# EAGLE design controller11 (EAGLE 8.3.1)

## Sheet 1 of 2
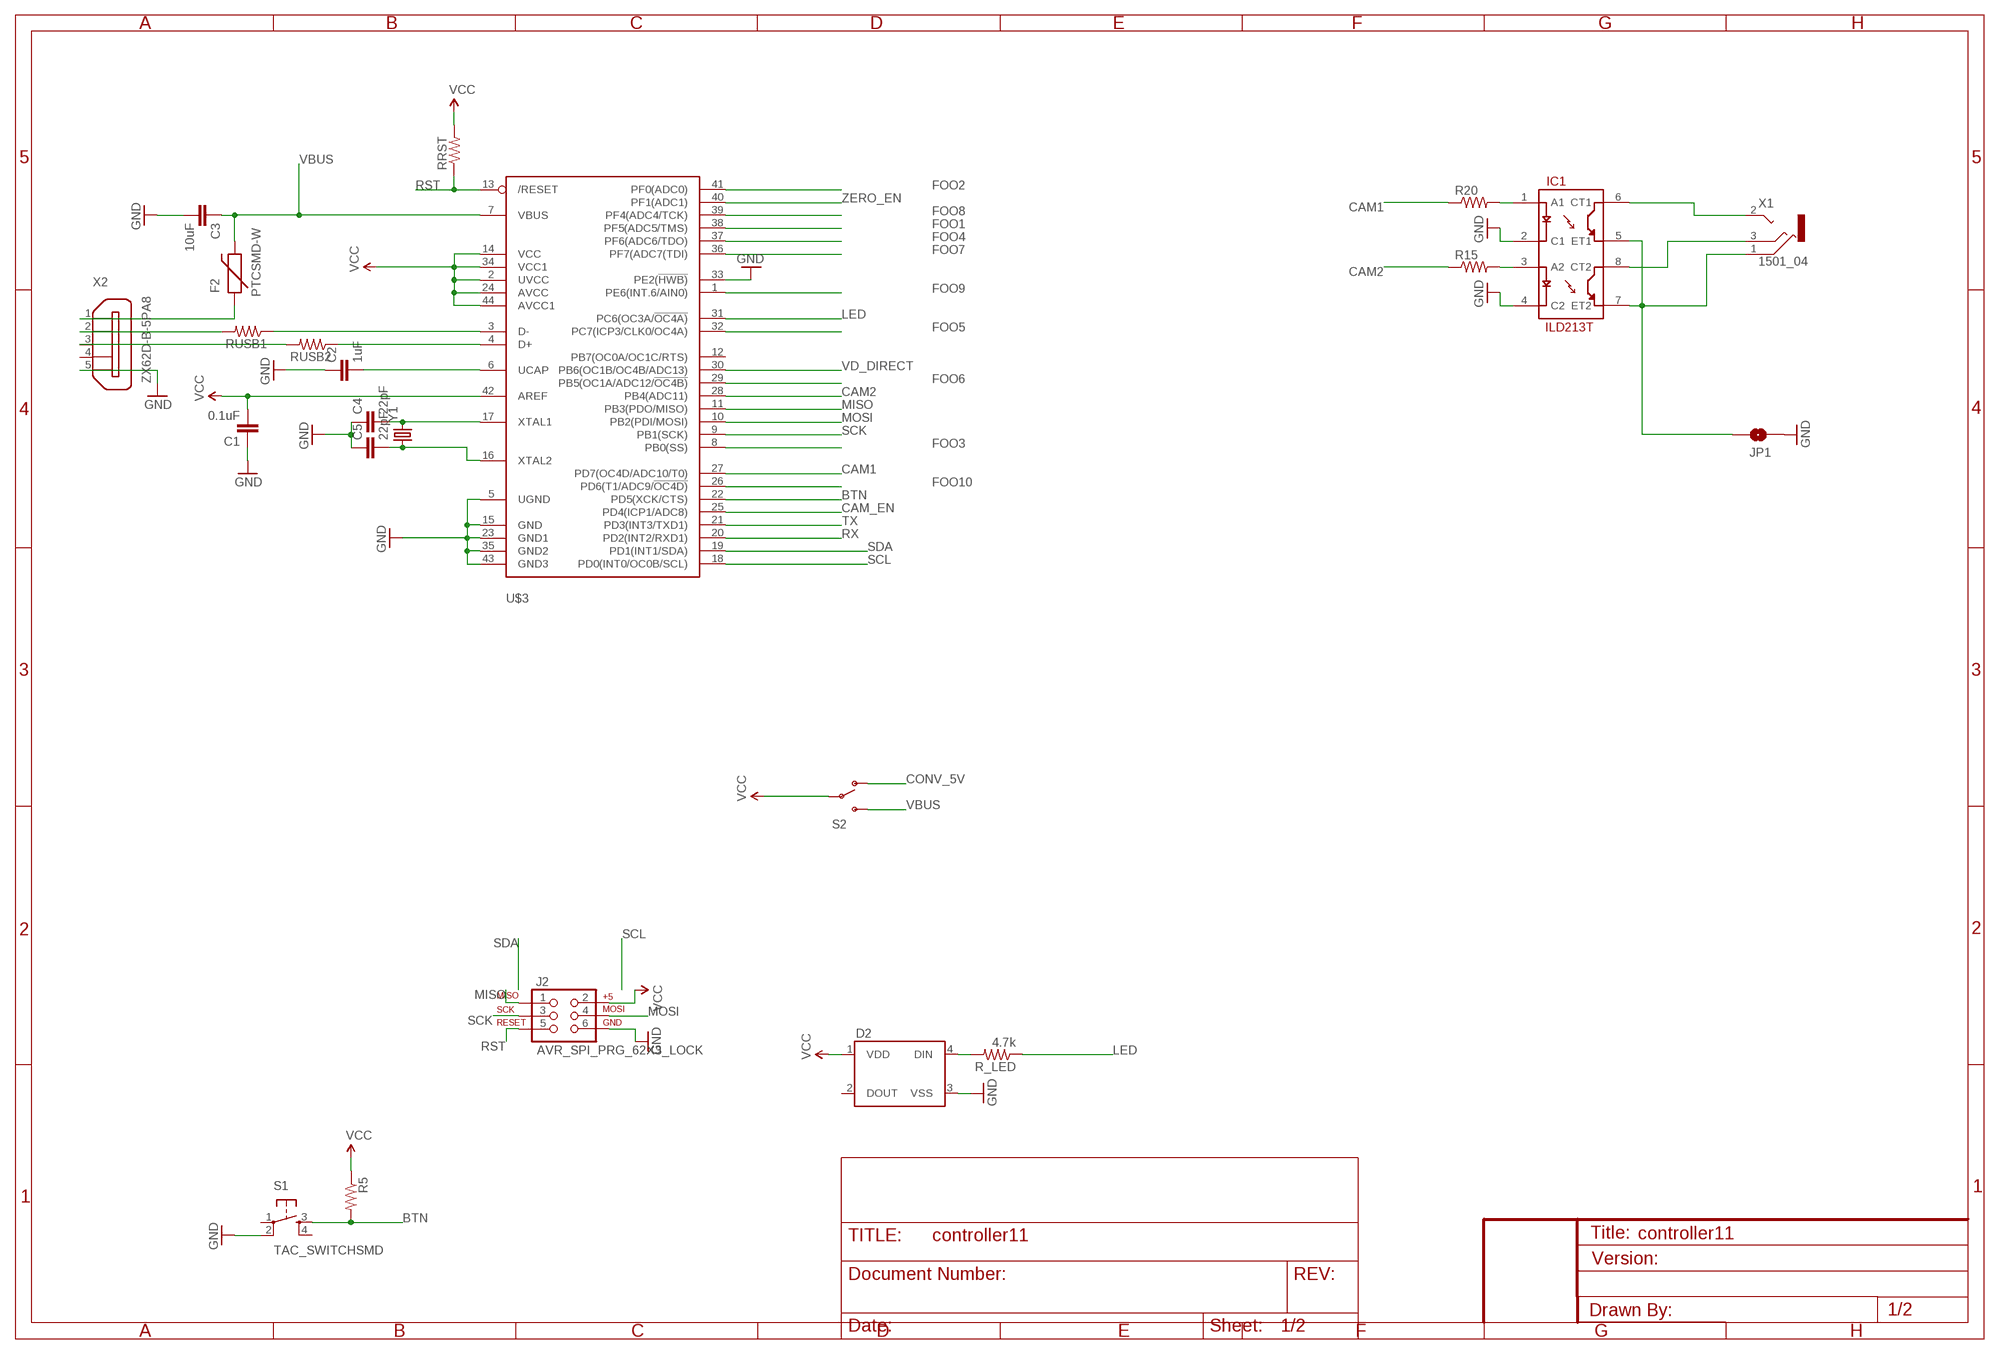
[diagram p0: schematic, sheet 1]

### Parts
C1  0.1uF  CAP1206  [1206]
C2  1uF  CAP1206  [1206]
C3  10uF  CAP1206  [1206]
C4  22pF  CAP1206  [1206]
C5  22pF  CAP1206  [1206]
D2  WS2812B  [WS2812B]
F2  PTCSMD-W  [PTC-1206-WIDE]
IC1  ILD213T  [SO08]
J2  AVR_SPI_PRG_62X3_LOCK  [2X3_LOCK]
JP1  JUMPER-PAD-2-NOYES_SILK  [PAD-JUMPER-2-NO_YES_SILK]
R5  RESISTOR1206  [1206]
R15  RESISTOR1206  [1206]
R20  RESISTOR1206  [1206]
R_LED  4.7k  RESISTOR1206  [1206]
RRST  RESISTOR1206  [1206]
RUSB1  RESISTOR1206  [1206]
RUSB2  RESISTOR1206  [1206]
S1  TAC_SWITCHSMD  [TACTILE-SWITCH-SMD]
S2  SWITCH-SPDTSMD2  [SWITCH-SPDT-SMD]
U$3  ATMEGA32U4-AU  [TQFP44]
X1  1501_04  [1501_05]
X2  ZX62D-B-5PA8  [ZX62D-B-5PA8]
Y1  CRYSTALCRYSTAL-SMD-5X3-16MHZ  [CRYSTAL-SMD-5X3]

### Nets
BTN: R5.2 S1.3 U$3.22(PD5(XCK/CTS))
CAM1: R20.1 U$3.27(PD7(OC4D/ADC10/T0))
CAM2: R15.1 U$3.28(PB4(ADC11))
CAM_EN: U$3.25(PD4(ICP1/ADC8)) ; also sheet 2
CONV_5V [power]: S2.1(O) ; also sheet 2
FOO1: U$3.38(PF5(ADC5/TMS))
FOO2: U$3.41(PF0(ADC0))
FOO3: U$3.8(PB0(SS))
FOO4: U$3.37(PF6(ADC6/TDO))
FOO5: U$3.32(PC7(ICP3/CLK0/OC4A))
FOO6: U$3.29(PB5(OC1A/ADC12/!OC4B))
FOO7: U$3.36(PF7(ADC7(TDI))
FOO8: U$3.39(PF4(ADC4/TCK))
FOO9: U$3.1(PE6(INT.6/AIN0))
FOO10: U$3.26(PD6(T1/ADC9/!OC4D))
GND: C1.1 C2.1 C3.2 C4.1 C5.1 D2.3(VSS) IC1.2(C1) IC1.4(C2) J2.6 JP1.1 S1.2 U$3.5(UGND) U$3.15(GND) U$3.23(GND1) U$3.33(PE2(!HWB)) U$3.35(GND2) U$3.43(GND3) X2.5 ; also sheet 2
LED: R_LED.1 U$3.31(PC6(OC3A/!OC4A))
MISO: J2.1 U$3.11(PB3(PDO/MISO))
MOSI: J2.4 U$3.10(PB2(PDI/MOSI))
N$4: RUSB1.1 U$3.3(D-)
N$5: RUSB2.1 U$3.4(D+)
N$7: D2.4(DIN) R_LED.2
N$8: C4.2 U$3.17(XTAL1) Y1.3
N$9: C5.2 U$3.16(XTAL2) Y1.1
N$10: RUSB1.2 X2.2
N$11: RUSB2.2 X2.3
N$12: IC1.6(CT1) X1.2
N$13: IC1.8(CT2) X1.3
N$15: IC1.3(A2) R15.2
N$19: IC1.1(A1) R20.2
N$20: C2.2 U$3.6(UCAP)
N$34: IC1.5(ET1) IC1.7(ET2) JP1.2 X1.1
N$38: F2.1 X2.1
RST: J2.5 RRST.1 U$3.13(/RESET)
RX: U$3.20(PD2(INT2/RXD1)) ; also sheet 2
SCK: J2.3 U$3.9(PB1(SCK))
SCL: U$3.18(PD0(INT0/OC0B/SCL))
SDA: U$3.19(PD1(INT1/SDA))
TX: U$3.21(PD3(INT3/TXD1)) ; also sheet 2
VBUS: C3.1 F2.2 S2.3(S) U$3.7(VBUS)
VCC [power]: C1.2 D2.1(VDD) J2.2 R5.1 RRST.2 S2.2(P) U$3.2(UVCC) U$3.14(VCC) U$3.24(AVCC) U$3.34(VCC1) U$3.42(AREF) U$3.44(AVCC1) ; also sheet 2
VD_DIRECT: U$3.30(PB6(OC1B/OC4B/ADC13)) ; also sheet 2
ZERO_EN: U$3.40(PF1(ADC1)) ; also sheet 2
Unconnected: D2.2(DOUT) S1.1 S1.4 U$3.12(PB7(OC0A/OC1C/RTS)) X2.4 X2.S1 X2.S2 X2.S3 X2.S4

## Sheet 2 of 2
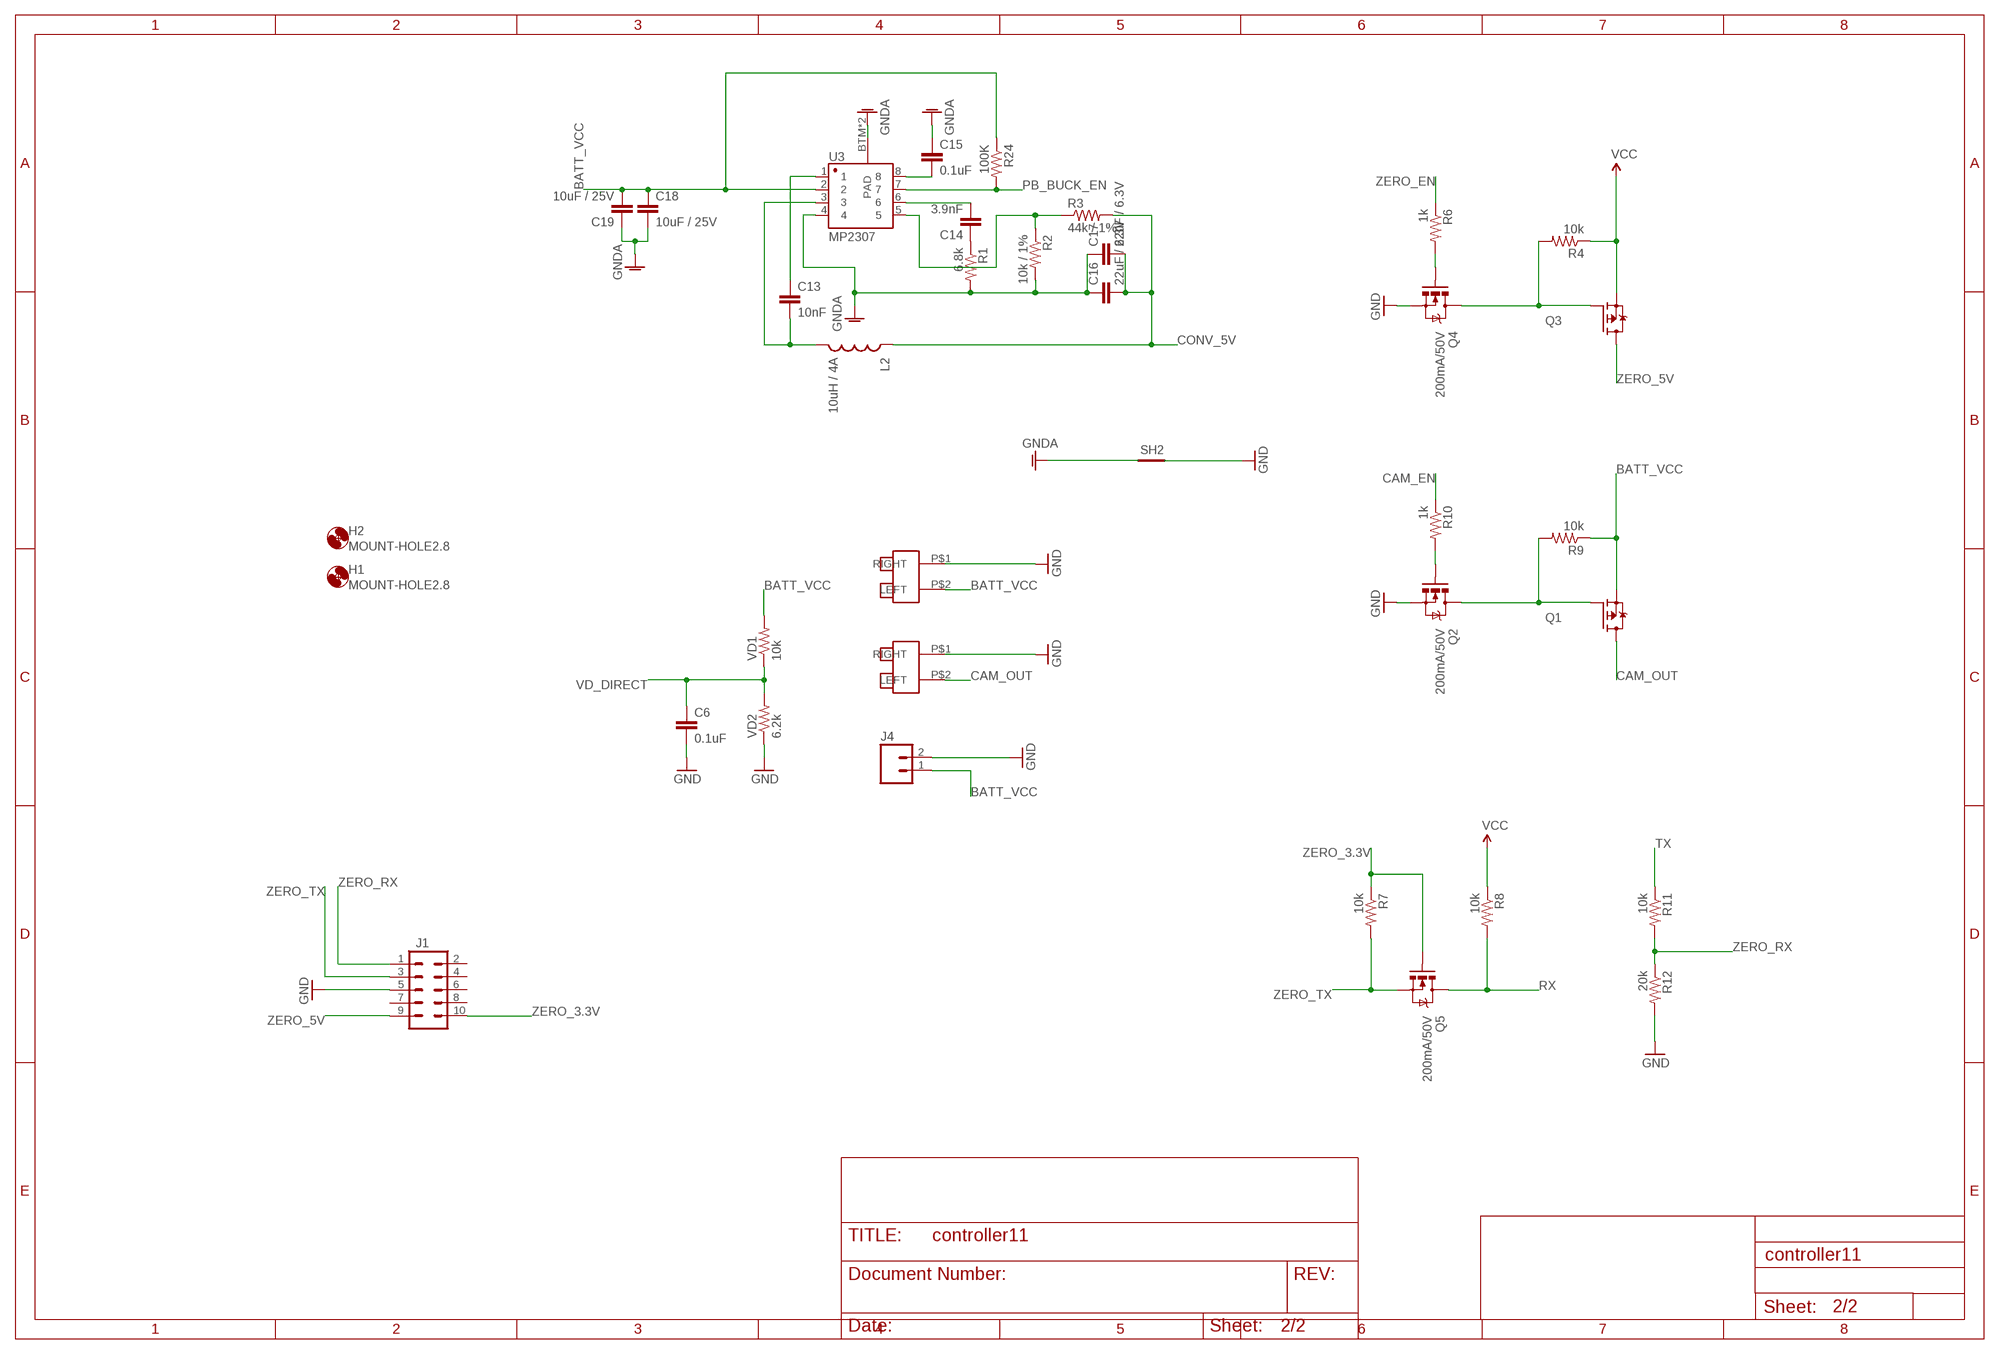
[diagram p1: schematic, sheet 2]

### Parts
C6  0.1uF  CAP1206  [1206]
C13  10nF  CAP1206  [1206]
C14  3.9nF  CAP1206  [1206]
C15  0.1uF  CAP1206  [1206]
C16  22uF / 6.3V  CAP1210  [1210]
C17  22uF / 6.3V  CAP1210  [1210]
C18  10uF / 25V  CAP1210  [1210]
C19  10uF / 25V  CAP1210  [1210]
H1  MOUNT-HOLE2.8  [2,8]
H2  MOUNT-HOLE2.8  [2,8]
J1  M05X2PTH  [AVR_ICSP]
J4  M02LOCK  [1X02_LOCK]
L2  10uH / 4A  INDUCTORSRU1038  [SRU1038]
Q1  FDD4141TO252  [TO252]
Q2  200mA/50V  MOSFET-NCHANNELBSS138  [SOT23-3]
Q3  FDD4141TO252  [TO252]
Q4  200mA/50V  MOSFET-NCHANNELBSS138  [SOT23-3]
Q5  200mA/50V  MOSFET-NCHANNELBSS138  [SOT23-3]
R1  6.8k  RESISTOR1206  [1206]
R2  10k / 1%  RESISTOR1206  [1206]
R3  44k / 1%  RESISTOR1206  [1206]
R4  10k  RESISTOR1206  [1206]
R6  1k  RESISTOR1206  [1206]
R7  10k  RESISTOR1206  [1206]
R8  10k  RESISTOR1206  [1206]
R9  10k  RESISTOR1206  [1206]
R10  1k  RESISTOR1206  [1206]
R11  10k  RESISTOR1206  [1206]
R12  20k  RESISTOR1206  [1206]
R24  100K  RESISTOR1206  [1206]
SH2  SHORT-HT5  [SHORT_TOP-50]
U3  MP2307  GENERIC-SOIC8MSGEQ7N-FILTER  [SO08]
U$4  NANOFIT2  [NANOFIT2]
U$5  NANOFIT2  [NANOFIT2]
VD1  10k  RESISTOR1206  [1206]
VD2  6.2k  RESISTOR1206  [1206]

### Nets
BATT_VCC [camera_power]: C18.1 C19.2 J4.1 Q1.2(S) R9.1 R24.1 U3.2 U$4.P$2(LEFT) VD1.2
CAM_EN: R10.1 ; also sheet 1
CAM_OUT [camera_power]: Q1.3(D) U$5.P$2(LEFT)
CONV_5V [power]: C16.2 C17.2 L2.1 R3.2 ; also sheet 1
GND: C6.2 J1.5 J4.2 Q2.2(S) Q4.2(S) R12.2 SH2.2 U$4.P$1(RIGHT) U$5.P$1(RIGHT) VD2.1 ; also sheet 1
GNDA [power]: C15.1 C16.1 C17.1 C18.2 C19.1 R1.2 R2.2 SH2.1 U3.4 U3.BTM(PAD) U3.P$1(PAD)
N$1: Q1.1(G) Q2.3(D) R9.2
N$2: Q4.1(G) R6.2
N$3: Q3.1(G) Q4.3(D) R4.2
N$6: Q2.1(G) R10.2
N$25: C15.2 U3.8
N$26 [power]: C13.2 L2.2 U3.3
N$27: C13.1 U3.1
N$28: C14.1 R1.1
N$29: C14.2 U3.6
N$30: R2.1 R3.1 U3.5
PB_BUCK_EN: R24.2 U3.7
RX: Q5.3(D) R8.2 ; also sheet 1
TX: R11.1 ; also sheet 1
VCC [power]: Q3.2(S) R4.1 R8.1 ; also sheet 1
VD_DIRECT: C6.1 VD1.1 VD2.2 ; also sheet 1
ZERO_3.3V: J1.10 Q5.1(G) R7.1
ZERO_5V [power]: J1.9 Q3.3(D)
ZERO_EN: R6.1 ; also sheet 1
ZERO_RX: J1.1 R11.2 R12.1
ZERO_TX: J1.3 Q5.2(S) R7.2
Unconnected: J1.2 J1.4 J1.6 J1.7 J1.8

## Library data of the parts
C1 C2 C6 C13-C19 = SparkFun-Capacitors:CAP: Capacitor Standard 0603 ceramic capacitor, and 0.1" leaded capacitor.
C3-C5 = SparkFun-Passives:CAP: Capacitor Standard 0603 ceramic capacitor, and 0.1" leaded capacitor.
D2 = SparkFun-LED:WS2812B: WS2812B - Intelligent control LED integrated light source Technical Specifications: Power Supply Voltage (VDD): 3.5 to 5.3 V Input Voltage (VI): -0.5 to VDD+0.5 V Operating Junction Temperature (Topt): -25°C to +80°C Storage Temperature Range (Tstg): -55°C to +150°C; PROD_ID: DIO-12503
F2 = SparkFun-PowerIC:PTC: Resettable Fuse PTC Resettable Fuse. Spark Fun Electronics SKU : COM-08357
H1 H2 = holes:MOUNT-HOLE: MOUNTING HOLE with drill center marker
IC1 = SparkFun-DiscreteSemi:ILD213T: Dual optoisolator.
J1 = SparkFun-Connectors:M05X2: Header 5x2 Standard 10-pin dual row 0.1" header. Commonly used with AVR-ISP. Use with Spark Fun Electronics SKU: PRT-00778
J2 = SparkFun-Connectors:AVR_SPI_PRG_6: AVR ISP 6 Pin This is the reduced ISP connector for AVR programming. Common on Arduino. This footprint will take up less PCB space and can be used with a 10-pin to 6-pin adapter such as SKU: BOB-08508 **Special note about "TEST_POINT" package. The stop mask is on the top side, so if you want your programming test points to be on the bottom of your board, make sure to place this package on the bottom side of the board. This also ensure that the orientation to program from the bottom side will be correct.
J4 = SparkFun-Connectors:M02: Standard 2-pin 0.1" header. Use with - straight break away headers ( PRT-00116) - right angle break away headers (PRT-00553) - swiss pins (PRT-00743) - machine pins (PRT-00117) - female headers (PRT-00115) Molex polarized connector foot print use with: PRT-08233 with associated crimp pins and housings. 2.54_SCREWTERM for use with PRT-10571. 3.5mm Screw Terminal footprints for PRT-08084 5mm Screw Terminal footprints for use with PRT-08432
JP1 = SparkFun-Passives:JUMPER-PAD-2-NO
L2 = SparkFun-Passives:INDUCTOR: Inductors Basic Inductor/Choke - 0603 and 1206. Footprints are not proven and vary greatly between part numbers. INDUCTOR POWER 3.3UH 4.0A SMD 0.197" L x 0.197" W x 0.177" H (5.00mm x 5.00mm x 4.50mm)
Q1 Q3 = transistor-fet:FDD4141: P-Channel PowerTrench® MOSFET Source: FDD4141.pdf
Q2 Q4 Q5 = SparkFun-DiscreteSemi:MOSFET-NCHANNEL: Common NMOSFET Parts MFG P/N Store ID Prod ID FDD8780 TRANS-09984 SI7820DN TRANS-11055 FDS6630A IC-08089 2N7002PW TRANS-11151 FQP30N06L COM-10213 TRANS-10060 BSS123LT1G TRANS-08345 BSS138 TRANS-00830 BS170 2N7000; PROD_ID: TRANS-00830
R1-R4 R6-R12 R24 R_LED = SparkFun-Resistors:RESISTOR: Resistor Basic schematic elements and footprints for 0603, 1206, and PTH resistors.
R5 R15 R20 RRST RUSB1 RUSB2 VD1 VD2 = SparkFun-Passives:RESISTOR: Resistor Basic schematic elements and footprints for 0603, 1206, and PTH resistors.
S1 = SparkFun-Retired:TAC_SWITCH: Momentary Switch Button commonly used for reset or general input. Spark Fun Electronics SKU : COM-00097 SMT- SWCH-08247; PROD_ID: SWCH-08247
S2 = SparkFun-Electromechanical:SWITCH-SPDT: SPDT Switch Simple slide switch, Spark Fun Electronics SKU : COM-00102 DPDT SMT slide switch, AYZ0202, SWCH-08179
SH2 = shorts:SHORT-H: Short between two nets; BOM: no
U3 = SparkFun-AnalogIC:GENERIC-SOIC8: A placeholder for generic narrow & wide SOIC8 foorptints - used on the DIP adapter board.; PROD_ID: IC-10141
U$3 = adafruit:ATMEGA32U4: http://www.ladyada.net/library/eagle
U$4 U$5 = volzolib:NANOFIT2
X1 = con-lumberg:1501_0*: Jack connectors according to JISC 6560, 2.5 mm Klinkensteckverbinder nach JISC 6560, 2,5 mm Source: http://www.lumberg.com/Produkte/PDFs/1501_05.pdfedit 1501_03 http://www.lumberg.com/Produkte/PDFs/1501_06.pdf; OC_FARNELL: 1216977; OC_NEWARK: unknown
X2 = zx62d-b-5pa8-oshpark_10:ZX62D-B-5PA8: Micro USB Type B Connector - Standard, Shell Through Hole Source: http://www.hirose.co.jp/cataloge_hp/ed_ZX_20140804.pdf; MF: Hirose; MPN: ZX62D-B-5PA8; OC_FARNELL: 2300438; OC_NEWARK: 69W0712
Y1 = SparkFun-FreqCtrl:CRYSTAL: Various standard crystals. Proven footprints.; PROD_ID: XTAL-08218

## Net classes
0 default: width 0.254 mm, clearance 0.254 mm
1 power: width 0.381 mm, clearance 0.254 mm
2 camera_power: width 0.66 mm, clearance 0.254 mm
3 usbsignal: width 0.254 mm, clearance 0.203 mm

## Board
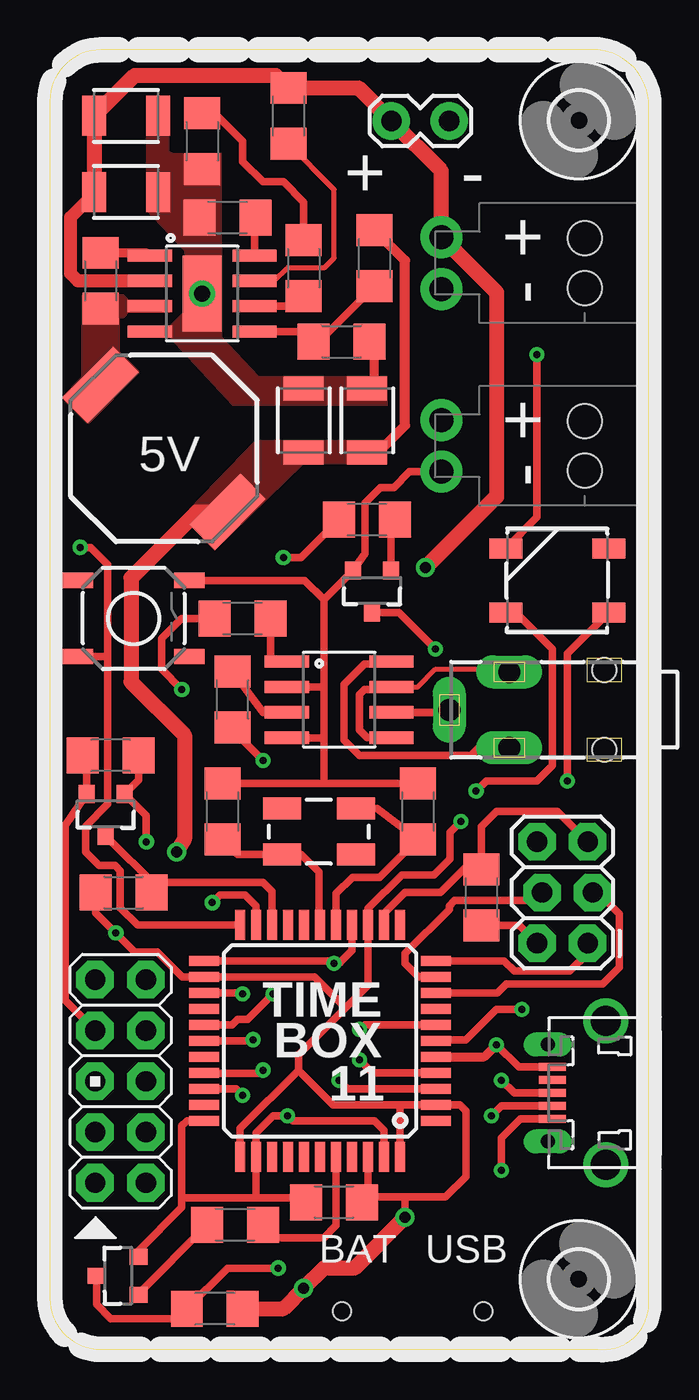
[diagram p2: board, top side]
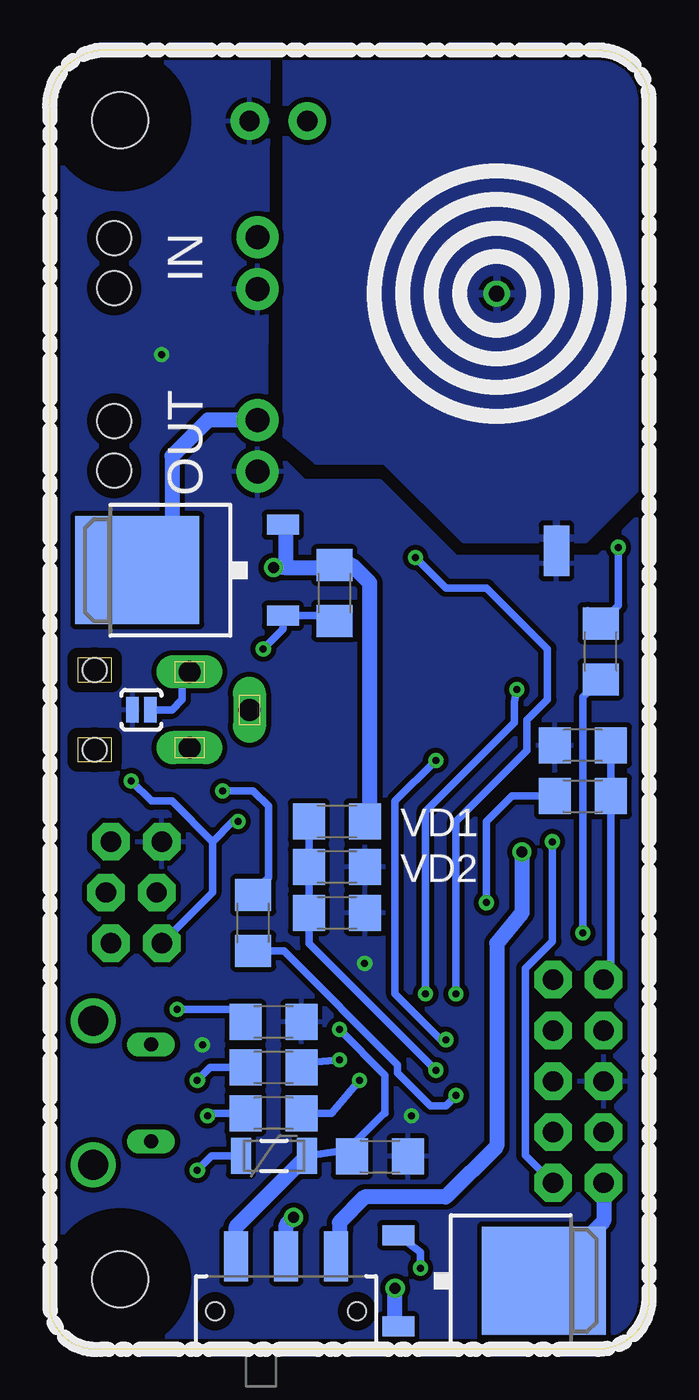
[diagram p3: board, bottom side, seen from below]

Size 29.98 x 65.04 mm. Coordinates in mm from the lower left corner, seen from the top.
Outline: 0,2.55 arc90 2.54,0.01 27.43,0.01 arc90 29.97,2.05 29.97,61.99 arc90 27.43,65.04 2.54,65.04 arc90 0,62.5 0,2.55
Copper layers (1*16): Top 0.035mm / dielectric 1.5mm / Bottom 0.035mm
Design rules "default *": minimum track width 10mil, minimum drill 24mil, track to track 8mil, track to pad 8mil, pad to pad 8mil, via to via 8mil, smd to smd 8mil, copper to edge 20mil, drill to drill 8mil, minimum pad ring 10mil, minimum via ring 8mil, stop-mask expansion 4mil, vias tented up to drill 0mil, thermal gap 10mil

### Footprints (pad centres in the part's own frame; a part is rotated, then mirrored left to right if it is on the bottom)
1206 = smd 1.6 x 1.8: 1 -1.4,0; 2 1.4,0
1210 = smd 1.2 x 2: 1 -1.6,0; 2 1.6,0
WS2812B = smd 1.651 x 1: 1 -2.577,1.6; 2 -2.577,-1.6; 3 2.577,-1.6; 4 2.577,1.6
PTC-1206-WIDE = smd 1 x 1.8: 1 -1.654,0; 2 1.654,0
2,8 = hole 2.8: 0,0
SO08 = smd 0.61 x 2.21: 1 -1.905,-2.616; 2 -0.635,-2.616; 3 0.635,-2.616; 4 1.905,-2.616; 5 1.905,2.616; 6 0.635,2.616; 7 -0.635,2.616; 8 -1.905,2.616
AVR_ICSP = drill 1.016 pad 1.88 octagon: 1 -1.27,5.08; 2 1.27,5.08; 3 -1.27,2.54; 4 1.27,2.54; 5 -1.27,0; 6 1.27,0; 7 -1.27,-2.54; 8 1.27,-2.54; 9 -1.27,-5.08; 10 1.27,-5.08
2X3_LOCK = drill 1.016 pad 1.88 octagon: 1 0,0; 2 0,2.54; 3 2.54,-0.254; 4 2.54,2.286; 5 5.08,0; 6 5.08,2.54
1X02_LOCK = drill 1.016 pad 1.88: 1 -0.178,0; 2 2.718,0
PAD-JUMPER-2-NO_YES_SILK = smd 0.635 x 1.27: 1 -0.45,0; 2 0.45,0
SRU1038 = smd 1.8 x 3.6: 1 -4.5,0; 2 4.5,0
TO252 = smd 1 x 1.6: 1 -2.28,-4.8; 2 2.28,-4.8 | smd 5.4 x 6.2: 3 0,2.5
SOT23-3 = smd 0.8 x 0.9: 1 -0.95,-1; 2 0.95,-1; 3 0,1.1
TACTILE-SWITCH-SMD = smd 1.524 x 0.762: 1 -2.794,1.905; 2 2.794,1.905; 3 -2.794,-1.905; 4 2.794,-1.905
SWITCH-SPDT-SMD = smd 1.2 x 2.5: 1 -2.5,-2.75; 2 0,-2.75; 3 2.5,-2.75 | hole 0.9: -3.55,0; 3.55,0
SHORT_TOP-50 = smd 1.27 x 1.27: 1 0.635,0; 2 -0.635,0
SO08' = smd 0.61 x 2.21: 1 -1.905,-2.616; 2 -0.635,-2.616; 3 0.635,-2.616; 4 1.905,-2.616; 5 1.905,2.616; 6 0.635,2.616; 7 -0.635,2.616; 8 -1.905,2.616 | smd 3.81 x 1.93: BTM 0,0 | drill 0.8: P$1 0,0
TQFP44 = smd 1.5 x 0.5: 1 -5.8,4; 2 -5.8,3.2; 3 -5.8,2.4; 4 -5.8,1.6; 5 -5.8,0.8; 6 -5.8,0; 7 -5.8,-0.8; 8 -5.8,-1.6; 9 -5.8,-2.4; 10 -5.8,-3.2; 11 -5.8,-4; 23 5.8,-4; 24 5.8,-3.2; 25 5.8,-2.4; 26 5.8,-1.6; 27 5.8,-0.8; 28 5.8,0; 29 5.8,0.8; 30 5.8,1.6; 31 5.8,2.4; 32 5.8,3.2; 33 5.8,4 | smd 0.5 x 1.5: 12 -4,-5.8; 13 -3.2,-5.8; 14 -2.4,-5.8; 15 -1.6,-5.8; 16 -0.8,-5.8; 17 0,-5.8; 18 0.8,-5.8; 19 1.6,-5.8; 20 2.4,-5.8; 21 3.2,-5.8; 22 4,-5.8; 34 4,5.8; 35 3.2,5.8; 36 2.4,5.8; 37 1.6,5.8; 38 0.8,5.8; 39 0,5.8; 40 -0.8,5.8; 41 -1.6,5.8; 42 -2.4,5.8; 43 -3.2,5.8; 44 -4,5.8
NANOFIT2 = drill 1.2 pad 2.1: P$1 10.38,1.3; P$2 10.38,-1.3 | hole 1.7: 3.2,1.25; 3.2,-1.25
1501_05 = drill 1.1 pad 1.4 long: 1 -1.9,-8.5; 2 0,-11.5; 3 1.9,-8.5 | hole 1.2: -2,-3.75; 2,-3.75
ZX62D-B-5PA8 = smd 1.35 x 0.4: 1 4.825,1.3; 2 4.825,0.65; 3 4.825,0; 4 4.825,-0.65; 5 4.825,-1.3 | drill 1.5: S1 2.15,-3.6; S2 2.15,3.6 | drill 0.7 long: S3 5.05,2.425; S4 5.05,-2.425
CRYSTAL-SMD-5X3 = smd 1.9 x 1.1: 1 -1.85,-1.15; 2 1.85,-1.15; 3 1.85,1.15; 4 -1.85,1.15

### Placement (x,y rotation side)
C1  14.22,7.38 0 top
C2  18.8,16.4 180 bottom
C3  13.46,9.67 0 bottom
C4  8.64,26.94 270 top
C5  18.41,26.94 270 top
C6  15.62,21.86 0 bottom
C13  2.54,53.48 270 top
C14  12.7,54.12 270 top
C15  8.89,56.66 0 top
C16  15.88,46.5 270 top
C17  12.7,46.5 270 top
C18  3.81,61.74 0 top
C19  3.81,57.93 180 top
D2  25.4,38.49 180 top
F2  18.77,9.69 0 bottom
H1  26.47,3.52 0 top
H2  26.48,61.52 0 top
IC1  14.48,32.53 270 top
J1  3.53,13.42 0 top
J2  26.92,20.33 90 top
J4  17.27,61.48 0 top
JP1  25.4,32.02 0 bottom
L2  5.71,45.1 135 top
Q1  23.11,39 90 bottom
Q2  16.13,37.99 180 top
Q3  7.75,3.44 270 bottom
Q4  3.43,3.7 90 top
Q5  2.79,26.81 180 top
R1  7.62,60.47 270 top
R2  14.61,50.43 0 top
R3  16.26,54.62 90 top
R4  8.26,2.05 180 top
R5  2.41,34.94 90 bottom
R6  9.27,6.24 180 top
R7  3.05,29.73 180 top
R8  3.68,22.87 0 top
R9  15.75,37.86 270 bottom
R10  15.88,41.54 0 top
R11  3.3,27.7 0 bottom
R12  3.3,30.24 180 bottom
R15  9.14,32.53 90 top
R20  9.65,36.59 0 top
R24  11.94,61.74 270 top
R_LED  19.81,21.35 90 bottom
RRST  21.59,22.62 270 top
RUSB1  18.8,11.82 180 bottom
RUSB2  18.8,14.11 180 bottom
S1  4.19,36.59 0 top
S2  18.16,1.92 180 bottom
SH2  4.62,39.97 90 bottom
U3  MP2307  [SO08']  7.62,52.85 270 top
U$3  13.53,15.45 180 top
U$4  29.97,54.37 180 top
U$5  29.97,45.23 180 top
VD1  15.62,26.43 0 bottom
VD2  15.62,24.14 180 bottom
X1  31.5,32.02 270 top
X2  29.97,12.84 180 top
Y1  13.46,25.92 180 top

### Tracks (layer width: path | path; a pad name or v marks a point on that pad's centre or on a via)
BATT_VCC  (via drill 0.55)
  Top 0.66: 2.29,57.93 C19.2 2.03,57.67 1.02,56.66 1.02,53.86 1.4,53.48 U3.2 | 2.29,61.74 C18.1
  Top 0.762: 2.21,61.66 C19.2 | 2.21,61.66 2.29,61.74 | 2.41,61.74 C18.1 4.24,63.77 11.31,63.77 R24.1 15.44,63.14 J4.1 19.59,58.98 U$4.P$2 22.35,52.91 22.35,42.69 v18.8,39.13 | 2.29,62.24 2.21,62.17 2.21,61.66
  Bottom 0.762: VD1.2 13.97,27.19 13.97,38.37 14.86,39.26 R9.1 15.88,39.13 18.18,39.13 | 18.18,39.13 v18.8,39.13 | Q1.2 18.18,41.15 18.18,39.13
BTN  (via drill 0.35)
  Top 0.381: 2.9,34.67 2.9,27.29 1.78,26.17 1.78,24.91 2.47,24.22 3.27,24.22 3.53,23.96 3.53,22.1 4.38,21.25 U$3.22 | 2.9,34.67 2.9,39.28 2.03,40.15 v1.52,40.15 | S1.3 2.88,34.68 2.9,34.67
  Bottom 0.381: 3.05,36.97 R5.2 1.52,37.23 v1.52,40.15
CAM1  (via drill 0.35)
  Top 0.381: U$3.27 9.12,16.25 9.4,16.52 9.91,16.52 v11.18,17.79 | R20.1 6.6,36.59 5.59,35.57 5.59,34.05 v6.6,33.03
  Bottom 0.381: v11.18,17.79 11.18,26.94 6.73,31.38 6.73,32.4 v6.6,33.03
CAM2  (via drill 0.35)
  Top 0.381: U$3.28 10.36,15.45 v10.16,15.51 | R15.1 9.02,31.13 v10.67,29.48
  Bottom 0.381: v10.67,29.48 12.7,27.45 12.7,17.79 10.41,15.51 v10.16,15.51
CAM_EN  (via drill 0.35)
  Top 0.381: U$3.25 9.6,17.85 v9.65,17.79 | R10.1 12.57,39.64 v11.68,39.64
  Bottom 0.381: v9.65,17.79 9.65,26.43 6.1,29.99 6.1,31.51 5.08,32.53 5.08,35.07 8.13,38.11 10.16,38.11 v11.68,39.64
CAM_OUT
  Bottom 0.762: U$5.P$2 22.07,46.53 23.88,44.72 23.88,39.47 Q1.3
CONV_5V  (via drill 0.55)
  Top 0.508: 16.51,44.59 16.18,44.59 C16.2 16.43,44.9 17.78,46.24 17.78,54.5 R3.2
  Top 0.762: L2.1 7.36,41.92 4.06,38.62 4.06,33.41 6.73,30.75 6.73,25.54 v6.35,24.91
  Bottom 0.762: v6.35,24.91 6.35,21.86 7.62,20.33 7.62,10.17 10.16,7.63 14.22,7.63 15.49,6.36 15.49,4.58 S2.1
  pour Top (no thermals): 16.89,45.48 10.29,45.48 6.99,42.05 6.99,41.29 8.26,40.02 12.7,44.34 16.64,44.34 16.76,44.72
GND  (via drill 0.35)
  Top 0.381: X2.5 23.46,14.14 v22.35,15.25 | U$3.15 15.13,19.97 14.48,19.32 v14.22,19.32 | 14.51,19.35 v14.22,19.32 | U$5.P$1 18,43.93 17.22,43.14 16.55,43.14 15.78,42.37 15.78,39.84 Q2.2 13.72,37.52 | 13.72,30.6 13.72,33.16 | 13.72,33.16 13.72,37.52 | 9.14,28.46 8.77,28.08 C4.1 13.72,28.34 | IC1.4 11.89,30.6 13.72,30.6 | IC1.2 | IC1.2 13.72,33.16 | v14.22,19.32 14.09,19.45 U$3.23 | D2.3 24.38,41.66 v24.38,49.8 | U$3.43 16.73,10.97 16.26,11.44 12.14,11.44 v11.89,11.7 11.18,11.7 10.33,10.85 U$3.35 10.33,7.64 10.27,7.58 | 17.78,28.72 18.16,28.34 C5.1 13.72,28.34 | 13.72,28.34 13.72,30.6 | U$3.33 6.86,11.45 6.6,11.19 6.6,7.52 | 10.27,7.58 8.13,7.58 | 8.13,7.58 7.9,7.58 | 10.27,7.58 12.62,7.58 C1.1 | S1.2 12.74,38.49 13.72,37.52 | Q4.2 4.43,4.95 6.6,7.13 6.6,7.52 | 8.13,7.58 6.66,7.58 6.6,7.52
  Top 0.457: U$3.5 21.75,14.65 v22.35,15.25
  pour Bottom: 29.84,0.01 0,0.01 0,42.18 2.54,39.64 9.65,39.64 13.46,43.45 17.27,43.45 19.18,45.35 19.05,65.16 29.84,65.04
GNDA
  Top 0.457: R2.2 16.26,50.31 16.26,48.53 C16.1
  pour Top (no thermals): 16.89,48.68 10.44,48.68 8.61,50.64 8.59,59.88 6.2,59.86 5.97,59.96 5.97,62.62 4.83,62.62 4.83,57.04 6.73,55 6.73,51.96 5.97,51.19 5.97,50.69 9.14,47.26 16.89,47.26
  pour Bottom: 0,65.29 0,43.7 3.17,40.53 9.27,40.53 13.21,44.46 16.64,44.46 18.16,45.73 18.16,65.29
LED  (via drill 0.35)
  Top 0.381: U$3.31 9.32,13.05 v9.65,12.71
  Bottom 0.381: R_LED.1 18.27,19.95 12.57,14.26 12.57,13.86 10.92,12.21 10.16,12.21 v9.65,12.71
MISO
  Top 0.381: U$3.11 22.73,19.45 23.24,18.94 26.04,18.94 26.92,19.83 J2.1
MOSI
  Top 0.381: U$3.10 18.45,18.65 17.78,19.32 17.78,19.83 19.99,22.04 19.99,22.2 20.25,22.46 24.23,22.46 J2.4
N$1  (via drill 0.35)
  Top 0.381: Q2.3 17.48,36.89 v19.3,35.07
  Bottom 0.254: R9.2 16.5,36.72
  Bottom 0.381: R9.2 16.01,36.72 Q1.1 18.31,36.06 v19.3,35.07
N$2
  Top 0.381: Q4.1 4.43,2.79 R6.2
N$3  (via drill 0.35)
  Top 0.381: Q4.3 2.33,2.26 3.05,1.54 6.35,1.54 R4.2 8.89,4.08 v11.43,4.08
  Bottom 0.381: Q3.1 11.43,4.86 v11.43,4.08
N$4  (via drill 0.35)
  Top 0.381: U$3.3 14.9,13.05 v14.48,13.48
  Bottom 0.381: RUSB1.1 15.88,11.82 v14.48,13.48
N$5  (via drill 0.35)
  Top 0.381: U$3.4 16.14,13.85 v15.49,14.49
  Bottom 0.381: RUSB2.1 16.89,14.36 v15.49,14.49
N$6
  Top 0.381: Q2.1 17.08,41.35 R10.2
N$7  (via drill 0.35)
  Top 0.381: D2.4 23.32,36.89 25.15,35.07 25.15,29.22 24.38,28.46 21.84,28.46 v21.34,27.95
  Bottom 0.381: v21.34,27.95 19.81,27.95 19.05,27.19 19.05,23.64 19.81,22.87 R_LED.2
N$8
  Top 0.381: U$3.17 13.46,21.32 13.46,23.89 12.58,24.77 Y1.3 9.4,24.77 8.76,25.41 | 8.76,25.41 9.15,25.03 | 8.76,25.41 C4.2
N$9
  Top 0.381: U$3.16 14.33,22.82 15.14,23.64 16.51,23.64 17.78,24.91 18.17,24.91 18.41,25.15 | 18.41,25.15 18.41,25.03 | 18.41,25.15 C5.2 16.37,27.07 Y1.1
N$10  (via drill 0.35)
  Top 0.381: X2.2 22.59,12.19 v22.1,11.7
  Bottom 0.381: 20.45,11.57 RUSB1.2 21.97,11.82 v22.1,11.7
N$11  (via drill 0.35)
  Top 0.381: X2.3 23.24,12.84 v22.61,13.48
  Bottom 0.381: RUSB2.2 21.97,14.11 v22.61,13.48
N$12
  Top 0.254: 17.22,32.02 IC1.6
  Top 0.381: IC1.6 20,31.89 X1.2
N$13
  Top 0.381: X1.3 21.47,30.12 21.08,29.73 15.49,29.73 14.73,30.49 14.73,33.29 15.75,34.3 16.97,34.3 IC1.8
N$15
  Top 0.381: IC1.3 10.67,31.89 R15.2
N$19
  Top 0.381: IC1.1 11.05,34.43 R20.2
N$20  (via drill 0.35)
  Top 0.381: U$3.6 19.39,15.51 20.83,15.51 22.35,17.03 v23.62,17.03
  Bottom 0.381: C2.2 20.32,17.03 v23.62,17.03
N$25
  Top 0.254: C15.2 10.24,56.6
  Top 0.381: U3.8 10.24,56.6 C15.2
N$26
  pour Top (no thermals): 5.97,52.46 3.94,52.46 3.68,52.72 1.65,52.72 1.65,48.65 0.64,47.64 1.91,46.37 4.45,48.91 3.43,49.92 3.43,51.7 3.68,51.7 3.94,51.96 5.97,51.96
N$27
  Top 0.254: 4.83,54.88 4.95,54.75 U3.1 | C13.1
  Top 0.457: 4.83,54.88 C13.1
N$28
  Top 0.381: C14.1 12.7,57.42 11.68,58.43 10.67,58.43 9.65,59.45 9.65,60.47 8.25,61.87 R1.1
N$29
  Top 0.381: U3.6 12.2,52.21 C14.2
N$30
  Top 0.254: R2.1 13.23,50.43 13.46,50.43
  Top 0.381: U3.5 12.73,50.94 13.23,50.43 | R2.1 13.46,50.43 R3.1
N$34
  Top 0.254: IC1.7 18.41,33.16 19.3,34.05 22.86,34.05 X1.1
  Top 0.381: IC1.5 15.88,30.62 15.49,31 15.49,32.78 15.75,33.03 16.97,33.03 IC1.7
  Bottom 0.381: JP1.2 23.88,32.02 23.37,32.53 23.37,33.55 X1.1
N$38  (via drill 0.35)
  Top 0.381: X2.1 25.12,11.55 23.55,11.55 22.61,10.61 v22.61,8.98
  Bottom 0.381: F2.1 21.89,9.69 v22.61,8.98
PB_BUCK_EN
  Top 0.254: U3.7 11.23,53.48 11.9,54.15 13.75,54.15 14.22,54.62 14.22,58.05 R24.2
RST
  Top 0.381: J2.5 25.4,26.94 22.35,26.94 21.59,26.18 RRST.1 21.21,24.14 20.83,24.14 19.56,22.87 17.78,22.87 16.73,21.82 U$3.13
RX
  Top 0.381: U$3.20 11.13,22.92 10.67,23.38 5.59,23.38 5.36,23.15 | 5.36,23.15 R8.2 | Q5.3 5.36,23.15
SCK
  Top 0.381: U$3.9 22.41,17.85 22.86,18.3 27.69,18.3 28.51,19.13 28.51,21.79 27.94,22.37 27.69,22.37 J2.3
TX  (via drill 0.35)
  Top 0.381: U$3.21 10.33,22.2 9.78,22.75 8.51,22.75 v8.13,22.37
  Bottom 0.381: R11.1 6.86,27.7 8.13,26.43 v8.13,22.37
VBUS  (via drill 0.35)
  Top 0.381: v15.49,16.02 15.77,16.25 U$3.7
  Bottom 0.381: F2.2 15.39,9.94 C3.1 14.86,10.22 13.21,11.88 | v15.49,16.02 13.21,13.73 13.21,11.88 | 13.21,11.88 13.21,11.83
  Bottom 0.762: S2.3 20.66,6.15 F2.2
VCC  (via drill 0.35, 0.55)
  Top 0.381: J2.2 23.5,21.22 RRST.2 | 15.65,7.38 15.93,7.43 U$3.42 | 15.65,7.38 C1.2 | U$3.34 9.53,11.07 12.45,13.98 | U$3.44 17.53,12.22 17.5,12.25 | C1.2 15.96,7.46 | 16.13,7.63 C1.2 | 15.65,7.38 15.91,7.63 17.82,7.63 | 16,21.18 U$3.14 | v25.91,28.46 25.91,34.83 D2.1 | 14.76,17.06 15.93,18.23 U$3.14 | v20.57,26.43 20.01,25.87 20.01,24.55 19.22,23.76 17.61,23.76 15.93,22.08 U$3.14 | 14.76,17.06 14.76,17.14 13.25,18.65 U$3.24 6.61,18.65 5.37,19.89 4.25,19.89 v3.3,20.84 2.28,21.86 R8.1 | 14.76,17.06 12.45,14.75 12.45,13.98 | 17.5,12.25 U$3.2 20.53,12.25 20.83,11.95 20.83,8.65 19.81,7.63 17.82,7.63 | 17.5,12.25 14.18,12.25 12.45,13.98 | v17.78,6.62 17.78,7.6 17.82,7.63
  Top 0.762: R4.1 11.68,2.05 v12.7,3.06 13.72,4.08 15.24,4.08 v17.78,6.62
  Bottom 0.381: 21.84,25.41 23.88,27.45 24.89,27.45 v25.91,28.46 | v20.57,26.43 20.83,26.43 21.84,25.41 | 21.84,25.41 21.84,22.87 J2.2 | v3.3,20.84 3.3,32.65 R5.1
  Bottom 0.762: S2.2 18.16,6.24 v17.78,6.62 | Q3.2 12.7,1.57 v12.7,3.06
VD_DIRECT  (via drill 0.35)
  Top 0.381: U$3.30 7.75,13.83 10.49,13.83 10.41,13.91 v10.67,13.98
  Bottom 0.381: VD1.1 VD2.2 C6.1 17.02,20.34 v10.67,13.98
ZERO_3.3V  (via drill 0.35)
  Top 0.381: R7.1 4.45,28.51 Q5.1 4.83,26.73 v4.83,25.41
  Bottom 0.381: J1.10 6.18,9.73 6.18,19.08 4.83,20.44 v4.83,25.41
ZERO_5V
  Bottom 0.457: 2.29,8.32 J1.9
  Bottom 0.762: J1.9 2.26,6.43 Q3.3
ZERO_EN
  Top 0.381: U$3.40 14.32,9.64 14.32,6.21 13.72,5.6 11.31,5.6 R6.1
ZERO_RX
  Bottom 0.381: R12.1 R11.2 1.9,18.86 J1.1
ZERO_TX
  Top 0.381: J1.3 0.76,17.46 0.76,26.22 Q5.2 1.84,29.54 R7.2

### Text on the board
tPlace: + | - | + | - | + | 5V | - | TIME | BOX | 11 | BAT | USB
bPlace: IN | OUT | VD1 | VD2